# Altium schematic sheet JTAG&Trace.SchDoc: JTAG & Trace
size A4; DocumentNumber: MB1219; Revision: B.1; SheetNumber: 17; SheetTotal: 17; Project: STM32F769I-EVAL
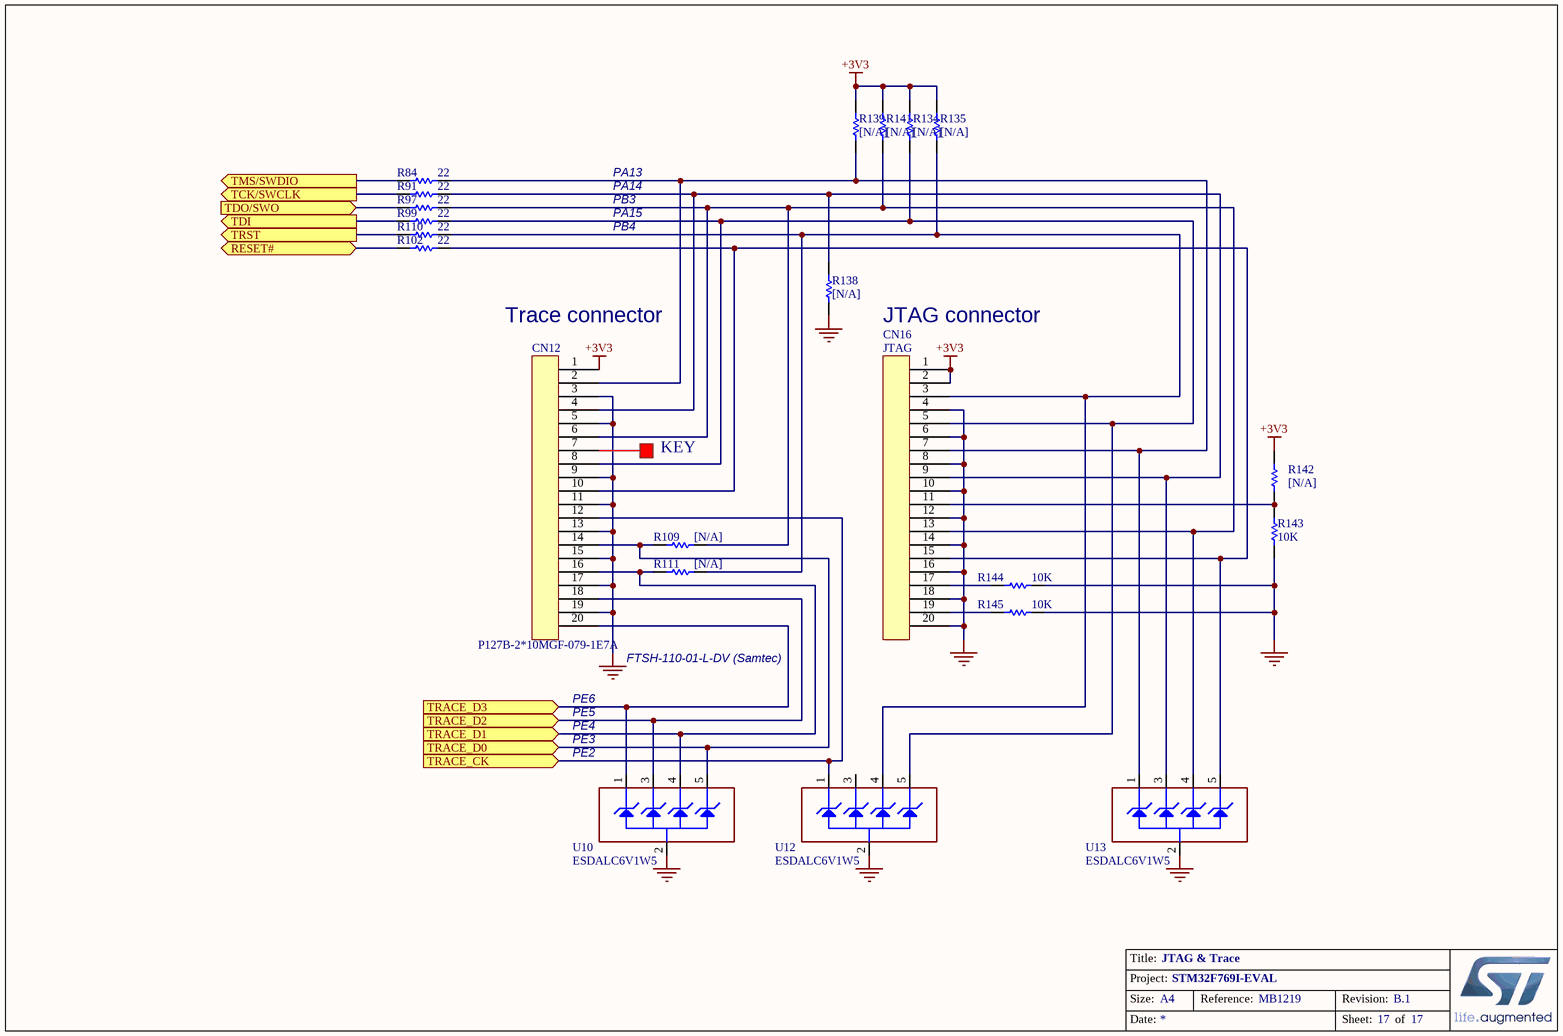
[diagram p0: JTAG&Trace.SchDoc]

## Parts
CN12  P127B-2*10MGF-079-1E7A  [FTSH-110-01-L-DV]
CN16  JTAG  [IDC20S]
R84  22  [0603R]
R91  22  [0603R]
R97  22  [0603R]
R99  22  [0603R]
R102  22  [0603R]
R109  [N/A]  [0603R]
R110  22  [0603R]
R111  [N/A]  [0603R]
R134  [N/A]  [0603R]
R135  [N/A]  [0603R]
R138  [N/A]  [0603R]
R139  [N/A]  [0603R]
R141  [N/A]  [0603R]
R142  [N/A]  [0603R]
R143  10K  [0603R]
R144  10K  [0603R]
R145  10K  [0603R]
U10  ESDALC6V1W5  [SOT-353]
U12  ESDALC6V1W5  [SOT-353]
U13  ESDALC6V1W5  [SOT-353]

## Ports
RESET# (bidir), TCK/SWCLK (out), TDI (out), TDO/SWO (in), TMS/SWDIO (out), TRACE_CK (in), TRACE_D0 (in), TRACE_D1 (in), TRACE_D2 (in), TRACE_D3 (in), TRST (out)

## Nets
+3V3: CN12.1 CN16.1 CN16.2 R134.2 R135.2 R139.2 R141.2 R142.2
GND: CN12.3 CN12.5 CN12.9 CN12.11 CN12.13 CN12.15 CN12.17 CN12.19 CN16.4 CN16.6 CN16.8 CN16.10 CN16.12 CN16.14 CN16.16 CN16.18 CN16.20 R138.1 R143.1 R144.1 R145.1 U10.2(GND) U12.2(GND) U13.2(GND)
RESET#: R102.2 ; port RESET#
TCK/SWCLK: R91.2 ; port TCK/SWCLK
TDI: R99.2 ; port TDI
TDO/SWO: R97.2 ; port TDO/SWO
TMS/SWDIO: R84.2 ; port TMS/SWDIO
TRACE_CK: CN12.12 U12.1(IO1) ; port TRACE_CK
TRACE_D0: CN12.14 R109.1 U10.5(IO4) ; port TRACE_D0
TRACE_D1: CN12.16 R111.1 U10.4(IO3) ; port TRACE_D1
TRACE_D2: CN12.18 U10.3(IO2) ; port TRACE_D2
TRACE_D3: CN12.20 U10.1(IO1) ; port TRACE_D3
TRST: R110.2 ; port TRST
NetCN12_2: CN12.2 CN16.7 R84.1 R139.1 U13.1(IO1)
NetCN12_4: CN12.4 CN16.9 R91.1 R138.2 U13.3(IO2)
NetCN12_6: CN12.6 CN16.13 R97.1 R109.2 R141.1 U13.4(IO3)
NetCN12_8: CN12.8 CN16.5 R99.1 R134.1 U12.5(IO4)
NetCN12_10: CN12.10 CN16.15 R102.1 U13.5(IO4)
NetCN16_3: CN16.3 R110.1 R111.2 R135.1 U12.4(IO3)
NetCN16_11: CN16.11 R142.1 R143.2
NetCN16_17: CN16.17 R144.2
NetCN16_19: CN16.19 R145.2

Not connected (* = marked no-connect by the designer): CN12 7; U12 3(IO2)

## Notes on the sheet
- PA13
- PA14
- PB3
- PA15
- PB4
- (near CN12) Trace connector
- JTAG connector
- KEY
- PE6
- PE5
- (near CN12) FTSH-110-01-L-DV (Samtec)
- PE4
- PE3
- (near U10) PE2
- Title:
- Project:
- Size:
- Date:
- A4
- Reference:
- Sheet:
- Revision:
- of

## Library data of the parts
CN12 CN16 = 20PIN1
R84 R91 R97 R99 R102 R109-R111 R134 R135 R138 R139 R141-R145 = Res1: Resistor; Value: 1K; Published: 8-Jun-2000; Revision: July-2002: Re-released for DXP Platform.; Publisher: Altium Limited
U10 U12 U13 = ESDALC6V1W5: Dual Transil array for ESD protection; Manuf_1: STM; Manuf_Part_1: ESDA5V3L; Ref St: 9179034; Provided: ST; ECCN_US/EU: EAR99/NEC; Distrib: ST; Order: ESDA5V3L; Ordered by: STM